# Altium schematic sheet [02] MCU.SchDoc
size A
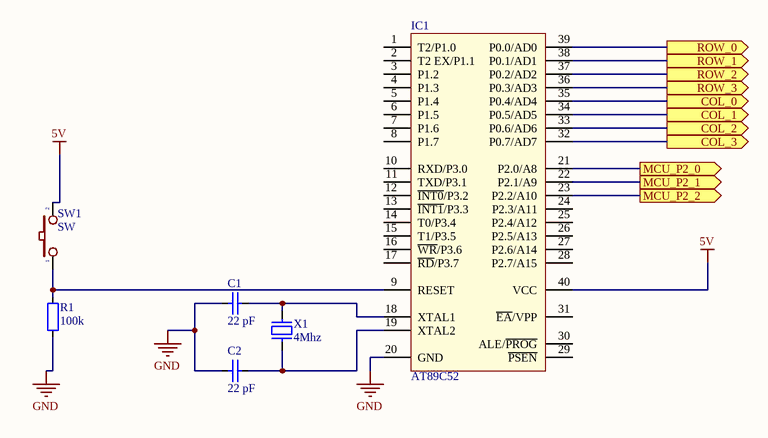
[diagram p0: [02] MCU.SchDoc]

## Parts
C1  22 pF  [CAP_0402]
C2  22 pF  [CAP_0402]
IC1  AT89C52  [DIP40/W0.6]
R1  100k  [RES-SMD-0805]
SW1  SW  [SW2]
X1  4Mhz  [XT2]

## Ports
COL_0 (out), COL_1 (out), COL_2 (out), COL_3 (out), MCU_P2_0 (out), MCU_P2_1 (out), MCU_P2_2 (out), ROW_0 (out), ROW_1 (out), ROW_2 (out), ROW_3 (out)

## Nets
5V: IC1.40(VCC) SW1.2
GND: C1.1 C2.2 IC1.20(GND) R1.1
COL_0: IC1.35(P0.4/AD4) ; port COL_0
COL_1: IC1.34(P0.5/AD5) ; port COL_1
COL_2: IC1.33(P0.6/AD6) ; port COL_2
COL_3: IC1.32(P0.7/AD7) ; port COL_3
MCU_P2_0: IC1.21(P2.0/A8) ; port MCU_P2_0
MCU_P2_1: IC1.22(P2.1/A9) ; port MCU_P2_1
MCU_P2_2: IC1.23(P2.2/A10) ; port MCU_P2_2
ROW_0: IC1.39(P0.0/AD0) ; port ROW_0
ROW_1: IC1.38(P0.1/AD1) ; port ROW_1
ROW_2: IC1.37(P0.2/AD2) ; port ROW_2
ROW_3: IC1.36(P0.3/AD3) ; port ROW_3
NetC1_2: C1.2 IC1.18(XTAL1) X1.1
NetC2_1: C2.1 IC1.19(XTAL2) X1.2
NetIC1_9: IC1.9(RESET) R1.2 SW1.1

Not connected (* = marked no-connect by the designer): IC1 1(T2/P1.0) 2(T2_EX/P1.1) 3(P1.2) 4(P1.3) 5(P1.4) 6(P1.5) 7(P1.6) 8(P1.7) 10(RXD/P3.0) 11(TXD/P3.1) 12(~{INT0}/P3.2) 13(~{INT1}/P3.3) 14(T0/P3.4) 15(T1/P3.5) 16(~{WR}/P3.6) 17(~{RD}/P3.7) 24(P2.3/A11) 25(P2.4/A12) 26(P2.5/A13) 27(P2.6/A14) 28(P2.7/A15) 29(~{PSEN}) 30(ALE/~{PROG}) 31(~{EA}/VPP)

## Library data of the parts
C1 C2 = CapSMD: Capacitor; Value: 33p; Published: 8-Jun-2000; LatestRevisionDate: 17-Jul-2002; LatestRevisionNote: Re-released for DXP Platform.; PackageReference: RAD-0.3; Publisher: Altium Limited
IC1 = AT89C52: Atmel AT89C52, 8k Byte Flash Memory , 40 Pin; Value: AT89C52
R1 = Resistor - SMD: Resistor; Manufacturer: Generic Components; Class: Passive; Published: 08/06/2000; Publisher: Altium Hobart Technology Centre
SW1 = SW2: Switch button 2 pin; Value: SW chip 2 pin
X1 = XT2: Crystal For all Crystal 2pin.; Value: 4Mhz